# Altium schematic sheet SRAM&OneNAND.SchDoc
size A4; Revision: C.2(PCB.SCH)
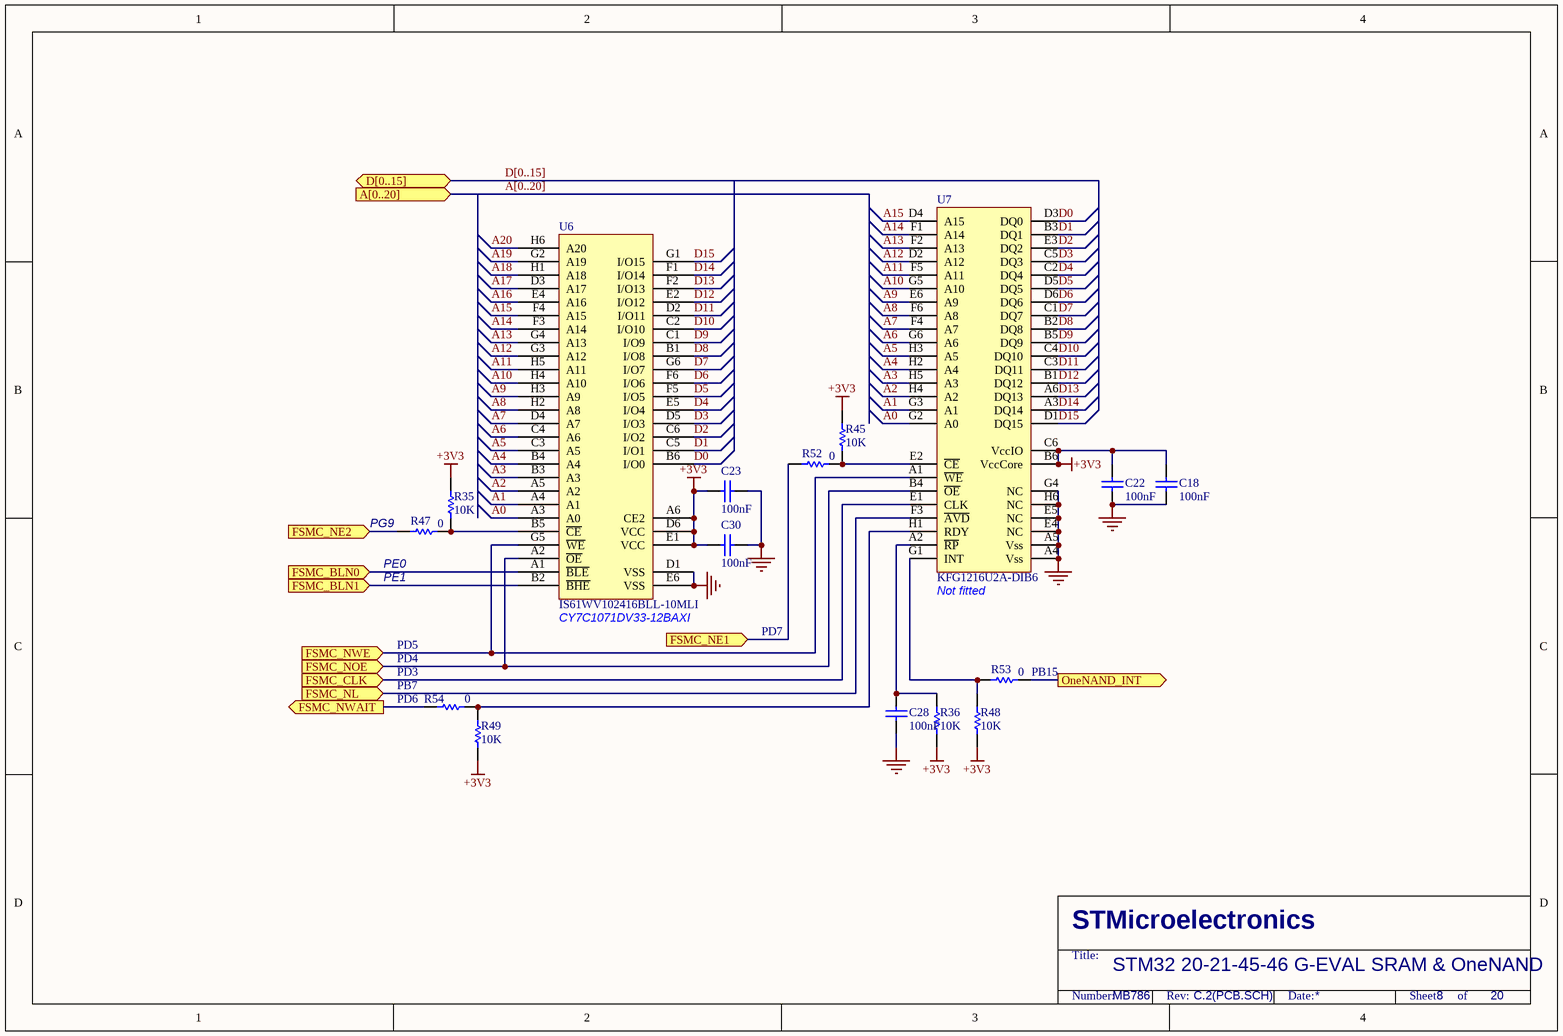
[diagram p0: SRAM&OneNAND.SchDoc]

## Parts
C18  100nF  [0402C]
C22  100nF  [0402C]
C23  100nF  [0402C]
C28  100nF  [0402C]
C30  100nF  [0402C]
R35  10K  [0402R]
R36  10K  [0402R]
R45  10K  [0402R]
R47  0  [0603R]
R48  10K  [0402R]
R49  10K  [0402R]
R52  0  [0603R]
R53  0  [0603R]
R54  0  [0603R]
U6  IS61WV102416BLL-10MLI  [FBGA48(9*11)]
U7  KFG1216U2A-DIB6  [FBGA63(9.5*12)]

## Ports
A[0..20] (in), D[0..15] (bidir), FSMC_BLN0 (in), FSMC_BLN1 (in), FSMC_CLK (in), FSMC_NE1 (in), FSMC_NE2 (in), FSMC_NL (in), FSMC_NOE (in), FSMC_NWAIT (out), FSMC_NWE (in), OneNAND_INT (out)

## Nets
+3V3: C18.1 C22.1 C23.2 C30.2 R35.2 R36.1 R45.2 R48.1 R49.1 U6.A6(CE2) U6.D6(VCC) U6.E1(VCC) U7.B6(VccCore) U7.C6(VccIO)
GND: C18.2 C22.2 C23.1 C28.1 C30.1 U6.D1(VSS) U6.E6(VSS) U7.A4(Vss) U7.A5(Vss) U7.E4(NC) U7.E5(NC) U7.G4(NC) U7.H6(NC)
A0: U6.A3(A0) U7.G2(A0)
A1: U6.A4(A1) U7.G3(A1)
A2: U6.A5(A2) U7.H4(A2)
A3: U6.B3(A3) U7.H5(A3)
A4: U6.B4(A4) U7.H2(A4)
A5: U6.C3(A5) U7.H3(A5)
A6: U6.C4(A6) U7.G6(A6)
A7: U6.D4(A7) U7.F4(A7)
A8: U6.H2(A8) U7.F6(A8)
A9: U6.H3(A9) U7.E6(A9)
A10: U6.H4(A10) U7.G5(A10)
A11: U6.H5(A11) U7.F5(A11)
A12: U6.G3(A12) U7.D2(A12)
A13: U6.G4(A13) U7.F2(A13)
A14: U6.F3(A14) U7.F1(A14)
A15: U6.F4(A15) U7.D4(A15)
A16: U6.E4(A16)
A17: U6.D3(A17)
A18: U6.H1(A18)
A19: U6.G2(A19)
A20: U6.H6(A20)
D0: U6.B6(I/O0) U7.D3(DQ0)
D1: U6.C5(I/O1) U7.B3(DQ1)
D2: U6.C6(I/O2) U7.E3(DQ2)
D3: U6.D5(I/O3) U7.C5(DQ3)
D4: U6.E5(I/O4) U7.C2(DQ4)
D5: U6.F5(I/O5) U7.D5(DQ5)
D6: U6.F6(I/O6) U7.D6(DQ6)
D7: U6.G6(I/O7) U7.C1(DQ7)
D8: U6.B1(I/O8) U7.B2(DQ8)
D9: U6.C1(I/O9) U7.B5(DQ9)
D10: U6.C2(I/O10) U7.C4(DQ10)
D11: U6.D2(I/O11) U7.C3(DQ11)
D12: U6.E2(I/O12) U7.B1(DQ12)
D13: U6.F2(I/O13) U7.A6(DQ13)
D14: U6.F1(I/O14) U7.A3(DQ14)
D15: U6.G1(I/O15) U7.D1(DQ15)
FSMC_BLN0: U6.A1(~{BLE}) ; port FSMC_BLN0
FSMC_BLN1: U6.B2(~{BHE}) ; port FSMC_BLN1
FSMC_CLK: U7.E1(CLK) ; port FSMC_CLK
FSMC_NE1: R52.2 ; port FSMC_NE1
FSMC_NE2: R47.2 ; port FSMC_NE2
FSMC_NL: U7.F3(~{AVD}) ; port FSMC_NL
FSMC_NOE: U6.A2(~{OE}) U7.B4(~{OE}) ; port FSMC_NOE
FSMC_NWAIT: R54.2 ; port FSMC_NWAIT
FSMC_NWE: U6.G5(~{WE}) U7.A1(~{WE}) ; port FSMC_NWE
OneNAND_INT: R53.1 ; port OneNAND_INT
NetC28_2: C28.2 R36.2 U7.A2(~{RP})
NetR35_1: R35.1 R47.1 U6.B5(~{CE})
NetR45_1: R45.1 R52.1 U7.E2(~{CE})
NetR48_2: R48.2 R53.2 U7.G1(INT)
NetR49_2: R49.2 R54.1 U7.H1(RDY)

## Buses and harness runs
bus A[0..20] = port A[0..20]
bus D[0..15] = port D[0..15]

## Notes on the sheet
- (near R47) PG9
- (near R47) PE0
- (near R47) PE1
- PD5
- (near U6) CY7C1071DV33-12BAXI
- PD7
- (near U7) Not fitted
- (near R54) PD4
- (near R54) PD3
- (near R54) PB7
- (near R54) PD6
- (near R53) PB15
- STM32 20-21-45-46 G-EVAL SRAM & OneNAND
- MB786
- 8
- 20
- STMicroelectronics
- Title:
- Number:
- Rev:
- Date:
- Sheet       of

## Library data of the parts
C18 C22 C23 C28 C30 = cap: Capacitor; Value: 100pF; Published: 8-Jun-2000; Revision: July-2002: Re-released for DXP Platform.; Publisher: Altium Limited
R35 R36 R45 R47-R49 R52-R54 = Res1: Resistor; Value: 1K; Published: 8-Jun-2000; Revision: July-2002: Re-released for DXP Platform.; Publisher: Altium Limited